# EAGLE design main (EAGLE 8.0.1)
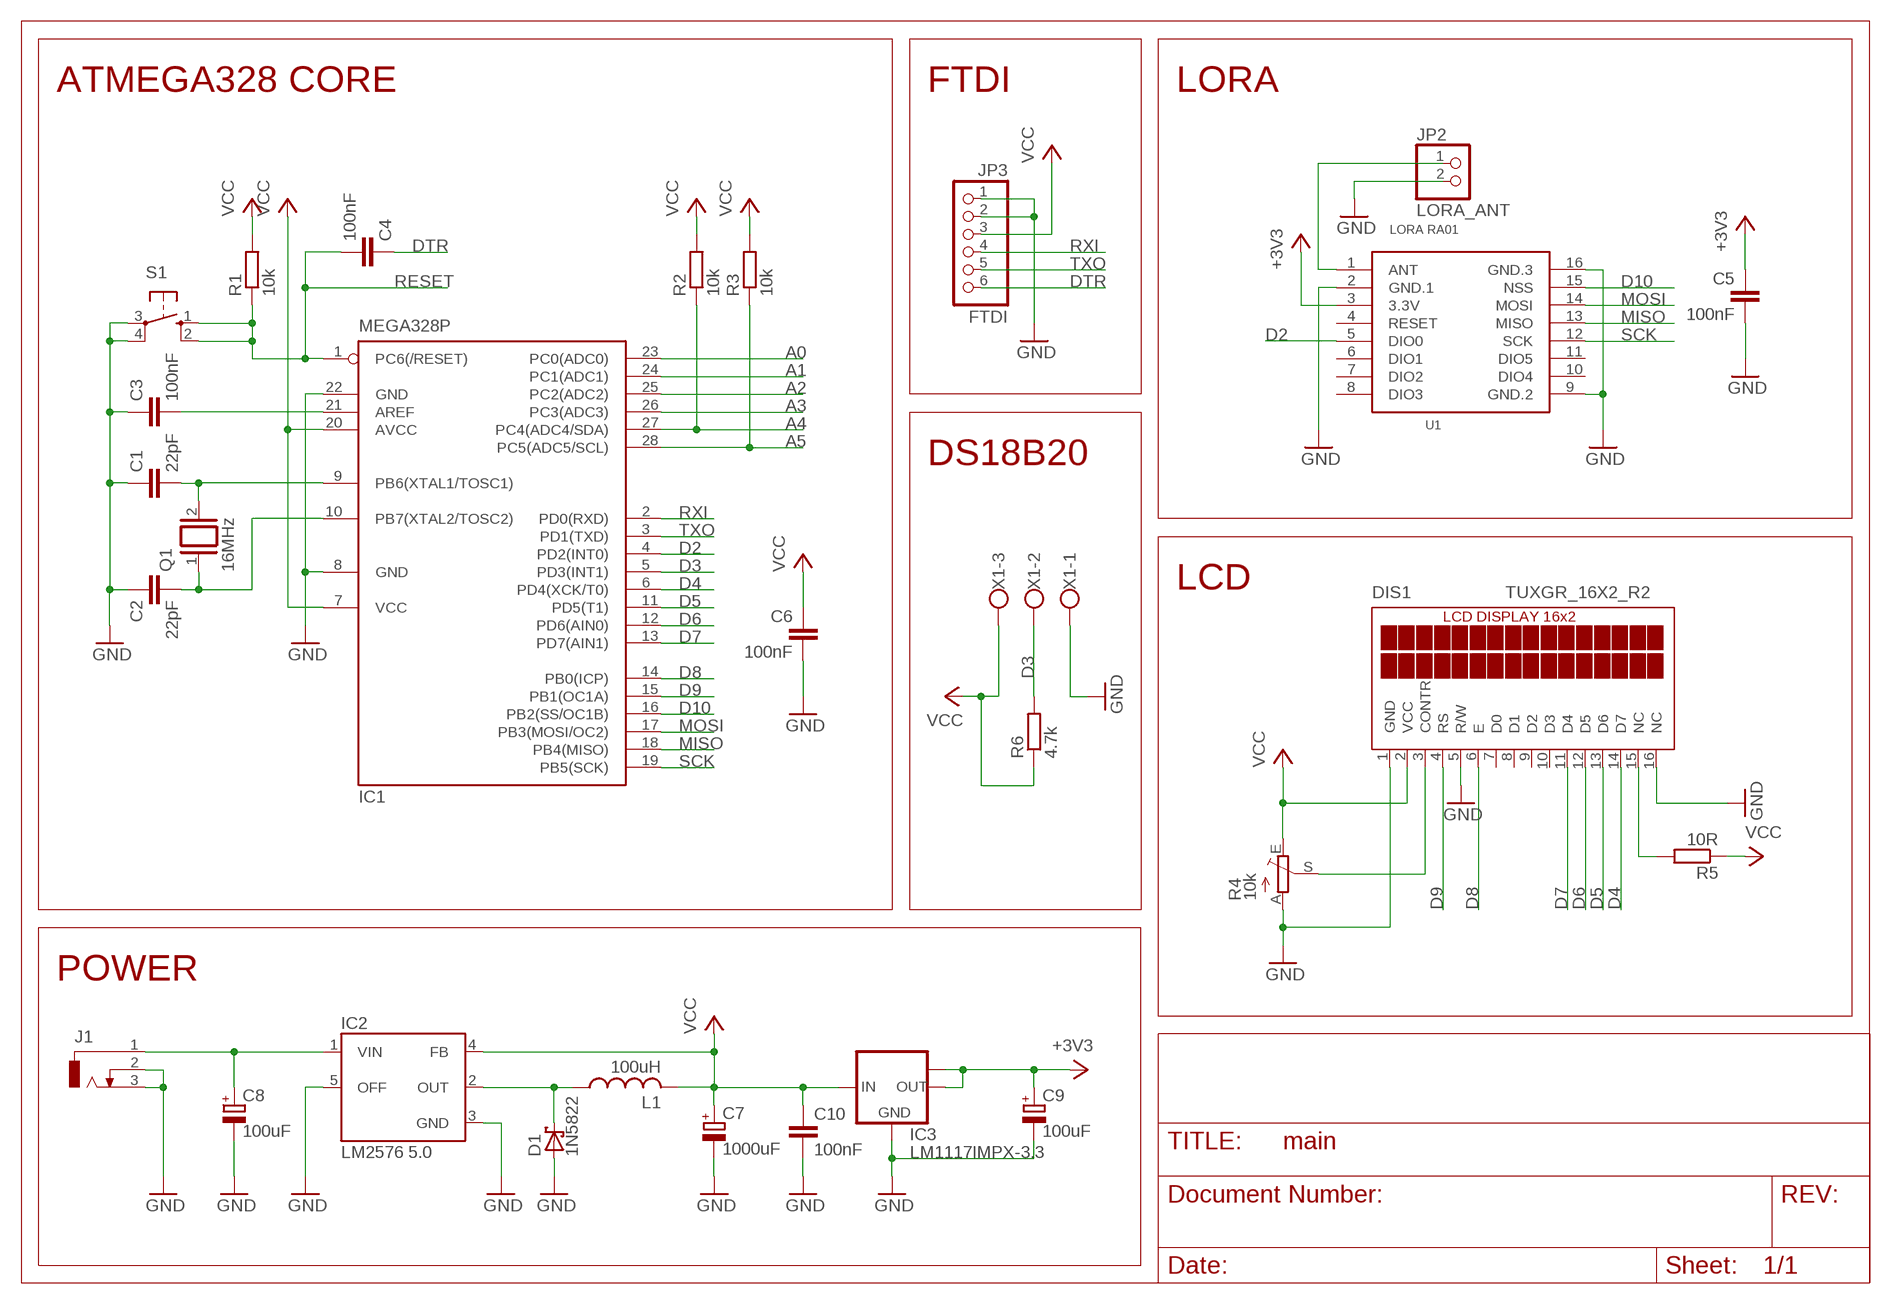
[diagram p0: schematic, sheet 1]

## Parts
C1  22pF  C-EU050-024X044  [C050-024X044]
C2  22pF  C-EU050-024X044  [C050-024X044]
C3  100nF  C-EU050-024X044  [C050-024X044]
C4  100nF  C-EU050-024X044  [C050-024X044]
C5  100nF  C-EU050-024X044  [C050-024X044]
C6  100nF  C-EU050-024X044  [C050-024X044]
C7  1000uF  CPOL-EUE5-13  [E5-13]
C8  100uF  CPOL-EUE5-8.5  [E5-8,5]
C9  100uF  CPOL-EUE3.5-10  [E3,5-10]
C10  100nF  C-EU050-024X044  [C050-024X044]
D1  1N5822  SCHOTTKY-DIODEDO201T15  [DO201T15]
DIS1  TUXGR_16X2_R2  [TUXGR_16X2_R2]
IC1  MEGA328P  MEGA8-P  [DIL28-3]
IC2  LM2576 5.0  LM2576S  [TO263-5]
IC3  LM1117IMPX-3.3  [SOT223]
J1  DCJ0303  [DCJ0303]
JP2  LORA_ANT  PINHD-1X2  [1X02]
JP3  FTDI  PINHD-1X6  [1X06]
L1  100uH  L-US6000-XXX-RC  [6000-XXXX-RC]
Q1  16MHz  XTAL/S  [QS]
R1  10k  R-EU_0207/10  [0207/10]
R2  10k  R-EU_0207/10  [0207/10]
R3  10k  R-EU_0207/10  [0207/10]
R4  10k  TRIM_EU-CA6V  [CA6V]
R5  10R  R-EU_0207/10  [0207/10]
R6  4.7k  R-EU_0207/10  [0207/10]
S1  10-XX  [B3F-10XX]
U1  LORA RA01  LORA-RA-01-433MHZ  [LORA-RA1-SMD]
X1  W237-103  [W237-103]

## Nets
+3V3: C5.1 C9.+ IC3.2(OUT) IC3.TAB(OUT1) U1.3(3.3V)
A0: IC1.23(PC0(ADC0))
A1: IC1.24(PC1(ADC1))
A2: IC1.25(PC2(ADC2))
A3: IC1.26(PC3(ADC3))
A4: IC1.27(PC4(ADC4/SDA)) R2.1
A5: IC1.28(PC5(ADC5/SCL)) R3.1
D2: IC1.4(PD2(INT0)) U1.5(DIO0)
D3: IC1.5(PD3(INT1)) R6.2 X1.2
D4: DIS1.14(D7) IC1.6(PD4(XCK/T0))
D5: DIS1.13(D6) IC1.11(PD5(T1))
D6: DIS1.12(D5) IC1.12(PD6(AIN0))
D7: DIS1.11(D4) IC1.13(PD7(AIN1))
D8: DIS1.6(E) IC1.14(PB0(ICP))
D9: DIS1.4(RS) IC1.15(PB1(OC1A))
D10: IC1.16(PB2(SS/OC1B)) U1.15(NSS)
DTR: C4.1 JP3.6
GND: C1.1 C2.1 C3.1 C5.2 C6.2 C7.- C8.- C9.- C10.2 D1.A DIS1.1(GND) DIS1.5(R/W) DIS1.16(NC) IC1.8(GND) IC1.22(GND) IC2.3(GND) IC2.5(OFF) IC3.1(GND) J1.2 J1.3 JP2.2 JP3.1 JP3.2 R4.A S1.3(P) S1.4(P1) U1.2(GND.1) U1.9(GND.2) U1.16(GND.3) X1.1
MISO: IC1.18(PB4(MISO)) U1.13(MISO)
MOSI: IC1.17(PB3(MOSI/OC2)) U1.14(MOSI)
N$1: JP2.1 U1.1(ANT)
N$5: C1.2 IC1.9(PB6(XTAL1/TOSC1)) Q1.2
N$6: C2.2 IC1.10(PB7(XTAL2/TOSC2)) Q1.1
N$8: C3.2 IC1.21(AREF)
N$9: C8.+ IC2.1(VIN) J1.1
N$10: D1.C IC2.2(OUT) L1.1
N$16: DIS1.15(NC) R5.2
N$17: DIS1.3(CONTR) R4.S
RESET: C4.2 IC1.1(PC6(/RESET)) R1.1 S1.1(S) S1.2(S1)
RXI: IC1.2(PD0(RXD)) JP3.4
SCK: IC1.19(PB5(SCK)) U1.12(SCK)
TXO: IC1.3(PD1(TXD)) JP3.5
VCC: C6.1 C7.+ C10.1 DIS1.2(VCC) IC1.7(VCC) IC1.20(AVCC) IC2.4(FB) IC3.3(IN) JP3.3 L1.2 R1.2 R2.2 R3.2 R4.E R5.1 R6.1 X1.3
Unconnected: DIS1.7(D0) DIS1.8(D1) DIS1.9(D2) DIS1.10(D3) U1.4(RESET) U1.6(DIO1) U1.7(DIO2) U1.8(DIO3) U1.10(DIO4) U1.11(DIO5)

## Notes on the sheet
- ATMEGA328 CORE | FTDI | LORA
- DS18B20
- LCD
- POWER

## Library data of the parts
C1-C6 C10 = rcl:C-EU: CAPACITOR, European symbol
C7-C9 = rcl:CPOL-EU: POLARIZED CAPACITOR, European symbol
D1 = diode:SCHOTTKY-DIODE: Schottky Diode
DIS1 = display-lcd:TUXGR_16X2_R2: Tuxgraphics LCD display 16x2 characters reflective, without background light Source: tuxgr_12x2_r2.pdf; OC_FARNELL: unknown; OC_NEWARK: unknown
IC1 = atmel:MEGA8-P: MICROCONTROLLER 8 Kbytes FLASH, 1 kbytes SRAM, 512 bytes EEPROM, USART, 4-channel 10 bit ADC, 2-channel 8 bit ADC Pin compatible with Atmega48, ATMega88, ATMega168 Source: avr.lbr; OC_FARNELL: unknown; OC_NEWARK: unknown
IC2 = lm2576:LM2576: National Semiconductor <http://www.national.com> 3.0A "Simple Switcher"(c) 52kHz, Vout 1.23-37V (HV: 57V), Vin 40V (HV: 60V), 50µA standby current
IC3 = lm1117:LM1117IMPX-*
J1 = con-jack:DCJ0303: DC POWER JACK Source: DCJ0303.pdf; OC_FARNELL: unknown; OC_NEWARK: unknown
JP2 = pinhead:PINHD-1X2: PIN HEADER
JP3 = pinhead:PINHD-1X6: PIN HEADER
L1 = rcl:L-US: INDUCTOR, American symbol
Q1 = special:XTAL/S: CRYSTAL
R1-R3 R5 R6 = rcl:R-EU_: RESISTOR, European symbol
R4 = pot:TRIM_EU-: POTENTIOMETER
S1 = switch-omron:10-XX: OMRON SWITCH; MPN: B3F-1000; OC_FARNELL: 176432; OC_NEWARK: 36M3542
U1 = lora:LORA-RA-01-433MHZ: 433 MHz Lora Ra-01 Radio Transceiver Module based on SX1278 chip.
X1 = con-wago-500:W237-103: WAGO SCREW CLAMP; MPN: 237-103; OC_FARNELL: unknown; OC_NEWARK: 18M7116

## Board
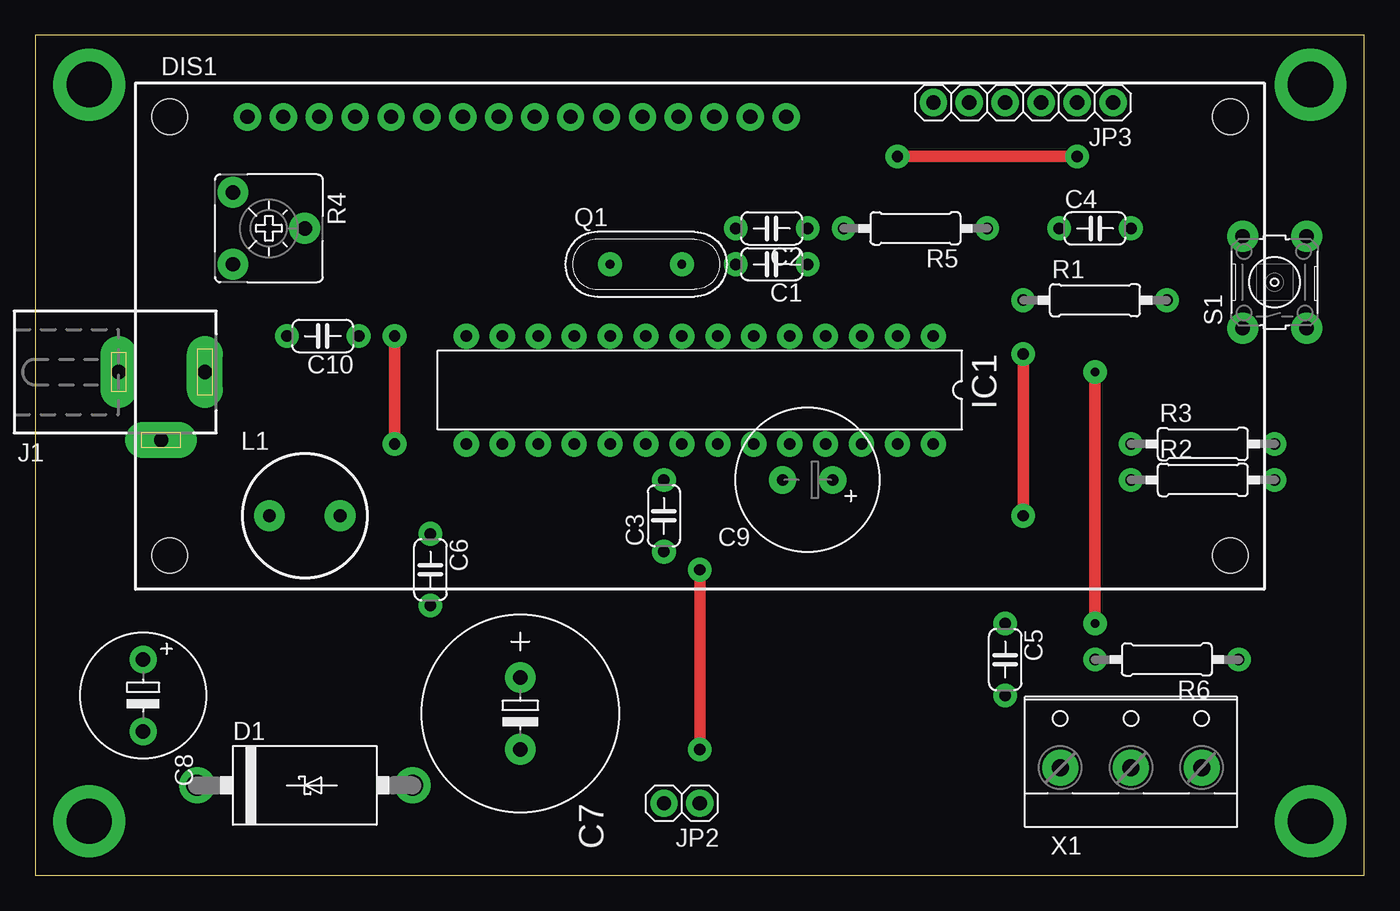
[diagram p1: board, top side]
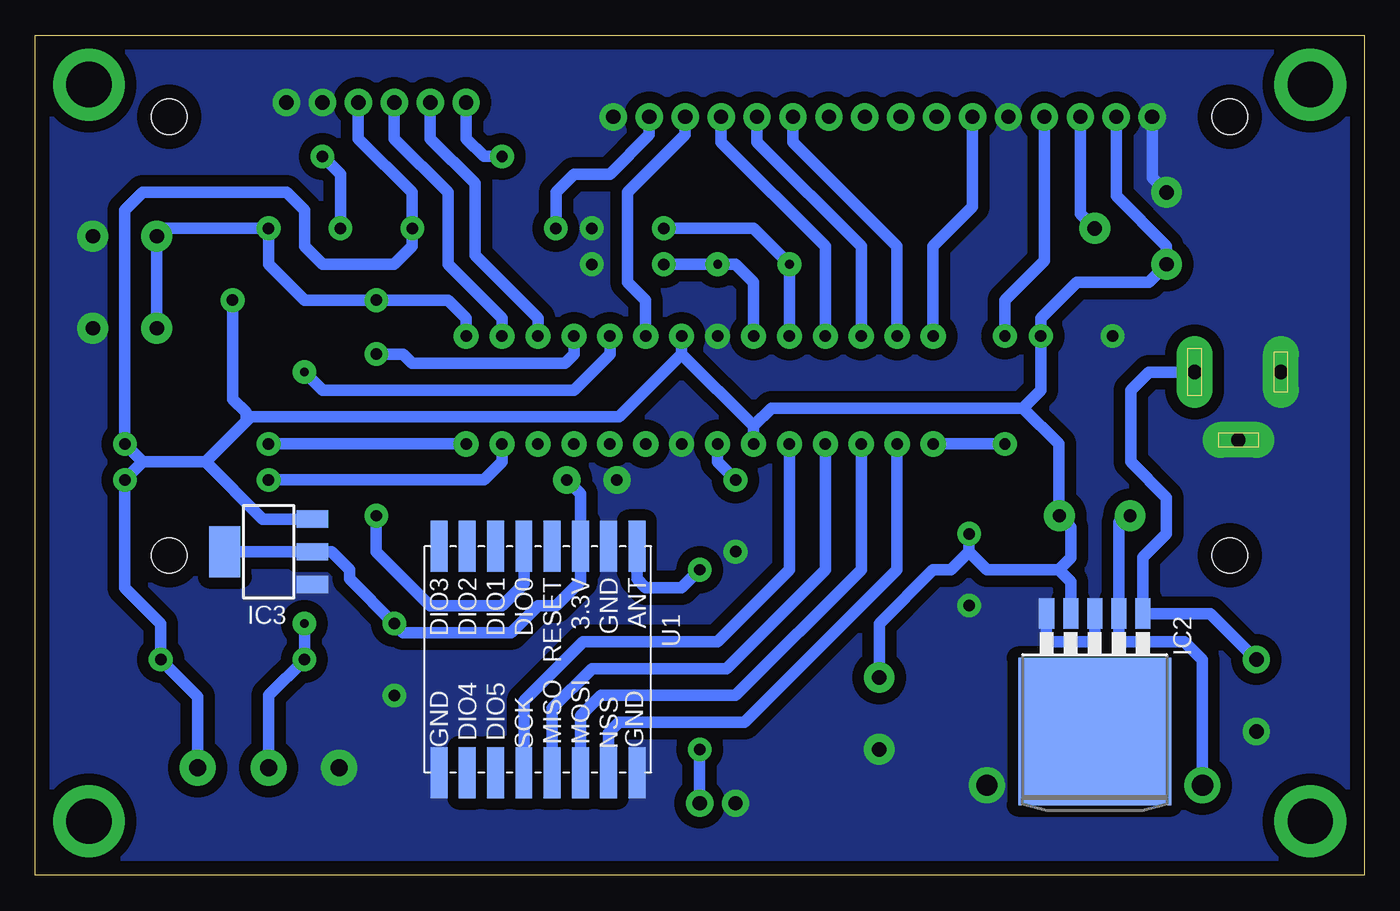
[diagram p2: board, bottom side, seen from below]

Size 93.96 x 59.36 mm. Coordinates in mm from the lower left corner, seen from the top.
Outline: 0,0 93.96,0 93.96,59.36 0,59.36 0,0
Copper layers (1*16): Top 0.035mm / dielectric 1.5mm / Bottom 0.035mm
Design rules "default": minimum track width 10mil, minimum drill 24mil, track to track 8mil, track to pad 8mil, pad to pad 8mil, via to via 8mil, smd to smd 8mil, copper to edge 40mil, drill to drill 8mil, minimum pad ring 10mil, minimum via ring 8mil, stop-mask expansion 4mil, vias tented up to drill 0mil, thermal gap 10mil

### Footprints (pad centres in the part's own frame; a part is rotated, then mirrored left to right if it is on the bottom)
C050-024X044 = drill 0.813 pad 1.676: 1 -2.54,0; 2 2.54,0
E5-13 = drill 1.016 pad 2.184: + -2.54,0; - 2.54,0
E5-8,5 = drill 1.016 pad 1.93: + -2.54,0; - 2.54,0
E3,5-10 = drill 0.813 pad 1.93: + -1.778,0; - 1.778,0
DO201T15 = drill 1.499 pad 2.54: A 7.62,0; C -7.62,0
TUXGR_16X2_R2 = drill 1 pad 1.93: 1 -32,15.5; 2 -29.46,15.5; 3 -26.92,15.5; 4 -24.38,15.5; 5 -21.84,15.5; 6 -19.3,15.5; 7 -16.76,15.5; 8 -14.22,15.5; 9 -11.68,15.5; 10 -9.14,15.5; 11 -6.6,15.5; 12 -4.06,15.5; 13 -1.52,15.5; 14 1.02,15.5; 15 3.56,15.5; 16 6.1,15.5 | hole 2.5: -37.5,-15.5; 37.5,-15.5; -37.5,15.5; 37.5,15.5
DIL28-3 = drill 0.813 pad 1.778: 1 -16.51,-3.81; 2 -13.97,-3.81; 3 -11.43,-3.81; 4 -8.89,-3.81; 5 -6.35,-3.81; 6 -3.81,-3.81; 7 -1.27,-3.81; 8 1.27,-3.81; 9 3.81,-3.81; 10 6.35,-3.81; 11 8.89,-3.81; 12 11.43,-3.81; 13 13.97,-3.81; 14 16.51,-3.81; 15 16.51,3.81; 16 13.97,3.81; 17 11.43,3.81; 18 8.89,3.81; 19 6.35,3.81; 20 3.81,3.81; 21 1.27,3.81; 22 -1.27,3.81; 23 -3.81,3.81; 24 -6.35,3.81; 25 -8.89,3.81; 26 -11.43,3.81; 27 -13.97,3.81; 28 -16.51,3.81
TO263-5 = smd 1.067 x 2.159: 1 -3.404,-5.791; 2 -1.702,-5.791; 3 0,-5.791; 4 1.702,-5.791; 5 3.404,-5.791 | smd 10.8 x 10.41: 6 0,2.54
SOT223 = smd 1.219 x 2.235: 1 -2.311,-3.099; 2 0,-3.099; 3 2.311,-3.099 | smd 3.6 x 2.2: TAB 0,3.099
DCJ0303 = drill 1 pad 2.54 long: 1 0,3.1; 2 4.8,0; 3 0,-3
1X02 = drill 1.016 pad 1.93: 1 -1.27,0; 2 1.27,0
1X06 = drill 1.016 pad 1.93: 1 -6.35,0; 2 -3.81,0; 3 -1.27,0; 4 1.27,0; 5 3.81,0; 6 6.35,0
6000-XXXX-RC = drill 0.9 pad 2.184: 1 -2.5,0; 2 2.5,0
QS = drill 0.61 pad 1.676: 1 -2.54,0; 2 2.54,0
0207/10 = drill 0.813 pad 1.676: 1 -5.08,0; 2 5.08,0
CA6V = drill 1.016 pad 2.184: A -2.54,-2.54; E 2.54,-2.54; S 0,2.54
B3F-10XX = drill 1.016 pad 2.184: 1 -3.251,2.261; 2 3.251,2.261; 3 -3.251,-2.261; 4 3.251,-2.261
LORA-RA1-SMD = smd 3.6 x 1.2: 1 -8,7; 2 -8,5; 3 -8,3; 4 -8,1; 5 -8,-1; 6 -8,-3; 7 -8,-5; 8 -8,-7; 9 8,-7; 10 8,-5; 11 8,-3; 12 8,-1; 13 8,1; 14 8,3; 15 8,5; 16 8,7
W237-103 = drill 1.194 pad 2.54: 1 -5,-1.29; 2 0,-1.29; 3 5,-1.29

### Placement (x,y rotation side)
C1  52.07,43.18 180 top
C2  52.07,45.72 180 top
C3  44.45,25.4 90 top
C4  74.93,45.72 0 top
C5  68.58,15.24 270 top
C6  27.94,21.59 270 top
C7  34.29,11.43 270 top
C8  7.62,12.7 270 top
C9  54.61,27.94 180 top
C10  20.32,38.1 180 top
D1  19.05,6.35 0 top
DIS1  46.99,38.1 0 top
IC1  46.99,34.29 180 top
IC2  19.05,12.7 180 bottom
IC3  77.47,22.86 90 bottom
J1  8.89,35.56 270 top
JP2  45.72,5.08 180 top
JP3  69.85,54.61 180 top
L1  19.05,25.4 0 top
Q1  43.18,43.18 0 top
R1  74.93,40.64 0 top
R2  82.55,27.94 0 top
R3  82.55,30.48 0 top
R4  16.51,45.72 270 top
R5  62.23,45.72 180 top
R6  80.01,15.24 180 top
S1  87.63,41.91 90 top
U1  58.42,15.24 270 bottom
X1  77.47,8.89 0 top

### Tracks (layer width: path | path; a pad name or v marks a point on that pad's centre or on a via)
+3V3
  Bottom 0.813: C9.+ 55.42,26.97 U1.3 55.42,20.78 57.15,19.05 58.42,19.05 60.33,17.14 67.94,17.14 C5.1 71.75,20.95 71.75,21.59 73.03,22.86 IC3.2 IC3.TAB
A4
  Bottom 0.813: IC1.27 60.96,29.21 62.23,27.94 R2.1
A5
  Bottom 0.813: IC1.28 R3.1
D2  (via drill 0.8 pad 1.68)
  Top 0.813: v69.85,36.83 v69.85,25.4
  Bottom 0.813: IC1.4 55.88,36.83 56.52,36.2 67.31,36.2 67.94,36.83 v69.85,36.83 | U1.5 59.42,20.59 60.96,19.05 66.04,19.05 69.85,22.86 v69.85,25.4
D3  (via drill 0.6 pad 1.68)
  Top 0.813: v74.93,35.56 v74.93,17.78
  Bottom 0.813: IC1.5 53.34,36.83 55.88,34.29 73.66,34.29 v74.93,35.56 | X1.2 77.47,12.7 R6.2 v74.93,17.78
D4
  Bottom 0.813: DIS1.14 48.01,52.32 52.07,48.26 52.07,41.91 50.8,40.64 IC1.6
D5
  Bottom 0.813: DIS1.13 45.47,51.82 38.1,44.45 IC1.11
D6
  Bottom 0.813: DIS1.12 42.93,51.82 35.56,44.45 IC1.12
D7
  Bottom 0.813: DIS1.11 40.39,51.82 33.02,44.45 IC1.13
D8
  Bottom 0.813: DIS1.6 27.69,47.24 30.48,44.45 IC1.14
D9  (via drill 0.8 pad 1.68)
  Top 0.813: v25.4,38.1 v25.4,30.48
  Bottom 0.813: DIS1.4 22.61,43.43 25.4,40.64 v25.4,38.1 | v25.4,30.48 IC1.15
D10
  Bottom 0.813: IC1.16 33.02,21.59 43.81,10.79 52.7,10.79 53.42,10.08 U1.15
DTR  (via drill 0.8 pad 1.68)
  Top 0.813: v60.96,50.8 v73.66,50.8
  Bottom 0.813: JP3.6 63.5,52.07 62.23,50.8 v60.96,50.8 | v73.66,50.8 72.39,49.53 C4.1
GND
  Bottom 0.813: DIS1.1 14.99,49.28 R4.A | IC2.3 19.05,16.51 22.45,16.51 IC2.5
  pour Bottom (isolate 0.813, no thermals): 0,59.69 93.98,59.69 93.98,0 0,0
MISO
  Bottom 0.813: IC1.18 38.1,21.59 45.09,14.61 54.61,14.61 57.42,11.79 U1.13
MOSI
  Bottom 0.813: IC1.17 35.56,21.59 44.45,12.7 53.98,12.7 55.42,11.26 U1.14
N$1  (via drill 0.8 pad 1.68)
  Top 0.813: v46.99,21.59 v46.99,8.89
  Bottom 0.813: U1.1 51.42,20.94 50.8,20.32 48.26,20.32 v46.99,21.59 | v46.99,8.89 JP2.1
N$2  (via drill 3.2 pad 5.08)
  other vias: 3.81,3.81
N$3  (via drill 3.2 pad 5.08)
  other vias: 90.17,3.81
N$4  (via drill 3.2 pad 5.08)
  other vias: 3.81,55.88
N$5
  Bottom 0.813: IC1.9 43.18,41.91 44.45,43.18 Q1.2 C1.2
N$6
  Bottom 0.813: IC1.10 Q1.1 43.18,45.72 C2.2
N$7  (via drill 3.2 pad 5.08)
  other vias: 90.17,55.88
N$8
  Bottom 0.813: IC1.21 45.72,29.21 C3.2
N$9
  Bottom 0.813: C8.+ 10.87,18.49 IC2.1 15.65,22.45 13.97,24.13 13.97,26.67 16.51,29.21 16.51,34.29 15.24,35.56 J1.1
N$10
  Bottom 0.813: L1.1 17.35,24.93 IC2.2 17.35,16.51 12.7,16.51 11.43,15.24 D1.C
N$16
  Bottom 0.813: DIS1.15 50.55,52.32 53.34,49.53 55.88,49.53 57.15,48.26 R5.2
N$17
  Bottom 0.813: DIS1.3 20.07,46.74 R4.S
RESET
  Bottom 0.813: S1.1 S1.2 84.81,45.72 C4.2 77.47,43.18 74.93,40.64 R1.1 64.77,40.64 63.5,39.37 IC1.1
RXI
  Bottom 0.813: JP3.4 68.58,52.07 64.77,48.26 64.77,43.18 60.96,39.37 IC1.2
SCK
  Bottom 0.813: IC1.19 40.64,21.59 45.72,16.51 55.24,16.51 59.42,12.34 U1.12
TXO
  Bottom 0.813: JP3.5 66.04,52.07 62.87,48.9 62.87,43.81 58.42,39.37 IC1.3
VCC
  Bottom 0.813: IC2.4 20.75,20.75 21.59,21.59 | DIS1.2 17.53,48.01 13.97,44.45 R4.E 15.24,41.91 20.32,41.91 22.86,39.37 C10.1 22.86,34.29 24.13,33.02 | X1.3 82.47,12.62 R6.1 85.09,17.78 87.63,20.32 R2.2 86.36,29.21 | JP3.3 71.12,52.07 67.31,48.26 R5.1 67.31,44.45 68.58,43.18 73.66,43.18 74.93,44.45 74.93,46.99 76.2,48.26 86.36,48.26 87.63,46.99 R3.2 86.36,29.21 | IC1.7 48.26,36.83 | 43.18,31.75 48.26,36.83 | 43.18,31.75 IC1.20 | 43.18,31.75 41.91,33.02 24.13,33.02 | C7.+ 34.29,17.78 30.48,21.59 29.21,21.59 27.94,22.86 | 21.59,21.59 20.75,22.43 20.75,24.6 L1.2 21.59,25.44 21.59,30.48 24.13,33.02 | 21.59,21.59 26.67,21.59 27.94,22.86 | 27.94,22.86 C6.1 | 48.26,36.83 52.7,32.38 78.74,32.38 79.06,32.07 | 81.92,29.21 86.36,29.21 | 81.92,29.21 77.88,25.17 IC3.3 | 79.06,32.07 81.92,29.21 | R1.2 80.01,33.66 79.06,32.7 79.06,32.07